# Altium project LED Oscilloscope.PrjPcb
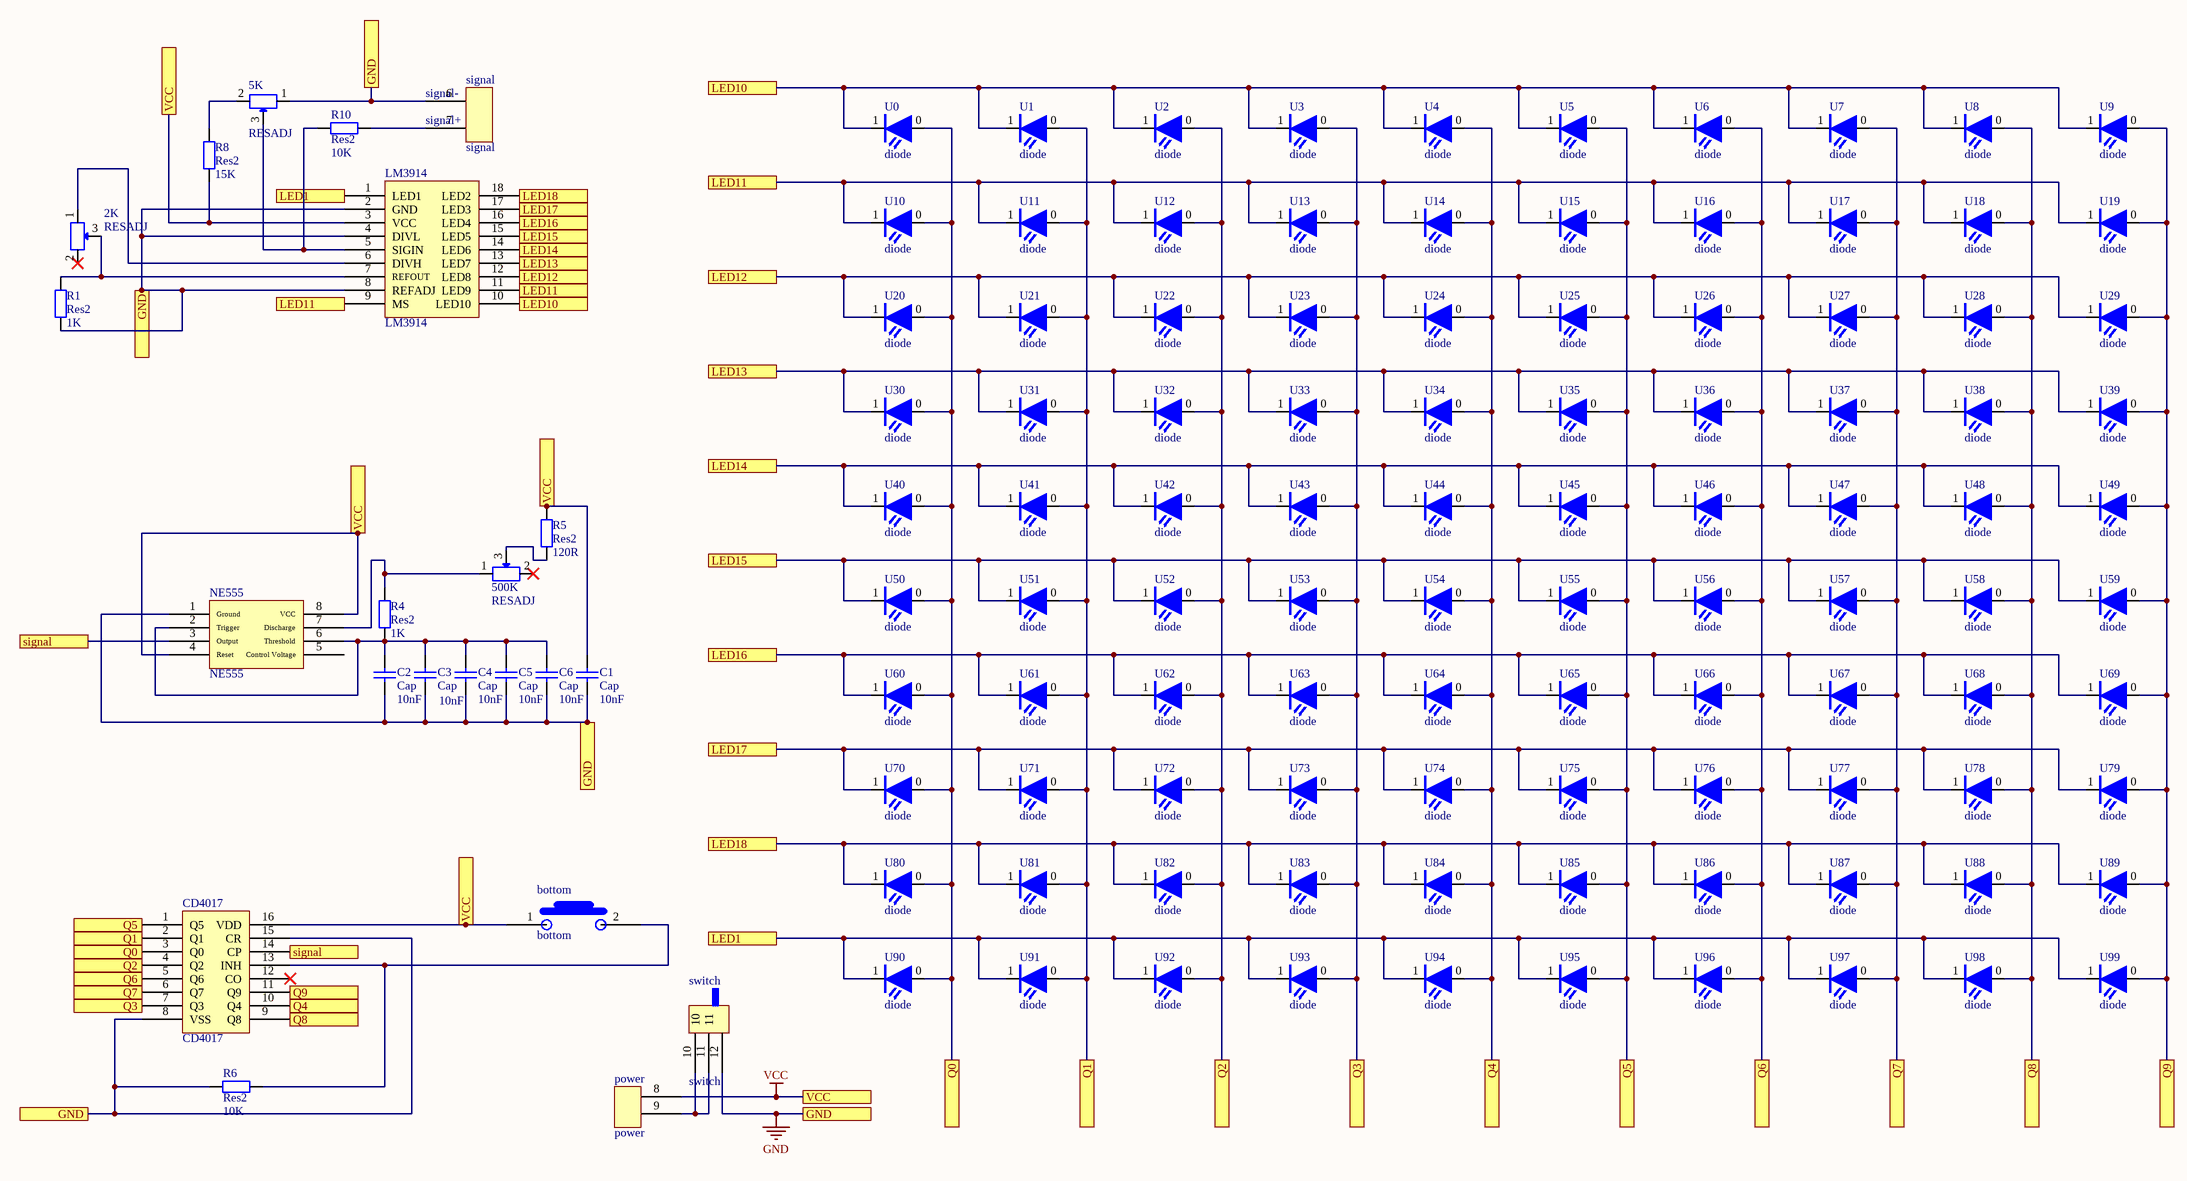
[diagram p0: LED Oscilloscope.SchDoc]
1 sheet, 122 parts. Net scope: flat (ports and power ports of the same name join across sheets).
Board file: LED Oscilloscope.PcbDoc

## Sheet LED Oscilloscope.SchDoc
size A2

### Parts
2K  RESADJ  [RESADJ]
5K  RESADJ  [RESADJ]
500K  RESADJ  [RESADJ]
bottom  bottom  [bottom]
C1  Cap  value 10nF  [RAD-0.3]
C2  Cap  value 10nF  [RAD-0.3]
C3  Cap  value 10nF  [RAD-0.3]
C4  Cap  value 10nF  [RAD-0.3]
C5  Cap  value 10nF  [RAD-0.3]
C6  Cap  value 10nF  [RAD-0.3]
CD4017  CD4017  [CD4017]
LM3914  LM3914  [LM3914]
NE555  NE555  [NE555 - duplicate]
power  power  [Power]
R1  Res2  value 1K  [AXIAL-0.4]
R4  Res2  value 1K  [AXIAL-0.4]
R5  Res2  value 120R  [AXIAL-0.4]
R6  Res2  value 10K  [AXIAL-0.4]
R8  Res2  value 15K  [AXIAL-0.4]
R10  Res2  value 10K  [AXIAL-0.4]
signal  signal  [signal]
switch  switch  [switch]
U0  diode  [LED]
U1  diode  [LED]
U2  diode  [LED]
U3  diode  [LED]
U4  diode  [LED]
U5  diode  [LED]
U6  diode  [LED]
U7  diode  [LED]
U8  diode  [LED]
U9  diode  [LED]
U10  diode  [LED]
U11  diode  [LED]
U12  diode  [LED]
U13  diode  [LED]
U14  diode  [LED]
U15  diode  [LED]
U16  diode  [LED]
U17  diode  [LED]
U18  diode  [LED]
U19  diode  [LED]
U20  diode  [LED]
U21  diode  [LED]
U22  diode  [LED]
U23  diode  [LED]
U24  diode  [LED]
U25  diode  [LED]
U26  diode  [LED]
U27  diode  [LED]
U28  diode  [LED]
U29  diode  [LED]
U30  diode  [LED]
U31  diode  [LED]
U32  diode  [LED]
U33  diode  [LED]
U34  diode  [LED]
U35  diode  [LED]
U36  diode  [LED]
U37  diode  [LED]
U38  diode  [LED]
U39  diode  [LED]
U40  diode  [LED]
U41  diode  [LED]
U42  diode  [LED]
U43  diode  [LED]
U44  diode  [LED]
U45  diode  [LED]
U46  diode  [LED]
U47  diode  [LED]
U48  diode  [LED]
U49  diode  [LED]
U50  diode  [LED]
U51  diode  [LED]
U52  diode  [LED]
U53  diode  [LED]
U54  diode  [LED]
U55  diode  [LED]
U56  diode  [LED]
U57  diode  [LED]
U58  diode  [LED]
U59  diode  [LED]
U60  diode  [LED]
U61  diode  [LED]
U62  diode  [LED]
U63  diode  [LED]
U64  diode  [LED]
U65  diode  [LED]
U66  diode  [LED]
U67  diode  [LED]
U68  diode  [LED]
U69  diode  [LED]
U70  diode  [LED]
U71  diode  [LED]
U72  diode  [LED]
U73  diode  [LED]
U74  diode  [LED]
U75  diode  [LED]
U76  diode  [LED]
U77  diode  [LED]
U78  diode  [LED]
U79  diode  [LED]
U80  diode  [LED]
U81  diode  [LED]
U82  diode  [LED]
U83  diode  [LED]
U84  diode  [LED]
U85  diode  [LED]
U86  diode  [LED]
U87  diode  [LED]
U88  diode  [LED]
U89  diode  [LED]
U90  diode  [LED]
U91  diode  [LED]
U92  diode  [LED]
U93  diode  [LED]
U94  diode  [LED]
U95  diode  [LED]
U96  diode  [LED]
U97  diode  [LED]
U98  diode  [LED]
U99  diode  [LED]

### Ports
GND, LED1, LED10, LED11, LED12, LED13, LED14, LED15, LED16, LED17, LED18, Q0, Q1, Q2, Q3, Q4, Q5, Q6, Q7, Q8, Q9, signal, VCC

### Nets
GND: 5K.1 C1.1 C2.1 C3.1 C4.1 C5.1 C6.1 CD4017.8(VSS) CD4017.15(CR) LM3914.2(GND) LM3914.4(DIVL) LM3914.8(REFADJ) NE555.1(Ground) R1.2 R6.1 signal.6 switch.12 ; port GND
VCC: bottom.1 C1.2 CD4017.16(VDD) LM3914.3(VCC) NE555.4(Reset) NE555.8(VCC) power.8 R5.1 R8.1 ; port VCC
Net2K_1: 2K.1 LM3914.6(DIVH)
Net2K_3: 2K.3 LM3914.7(REFOUT) R1.1
Net5K_2: 5K.2 R8.2
Net5K_3: 5K.3 LM3914.5(SIGIN) R10.1
Net500K_1: 500K.1 NE555.7(Discharge) R4.1
Net500K_3: 500K.3 R5.2
Netbottom_2: bottom.2 CD4017.13(INH) R6.2
NetC2_2: C2.2 C3.2 C4.2 C5.2 C6.2 NE555.2(Trigger) NE555.6(Threshold) R4.2
NetCD4017_1: CD4017.1(Q5) U5.0 U15.0 U25.0 U35.0 U45.0 U55.0 U65.0 U75.0 U85.0 U95.0 ; port Q5
NetCD4017_2: CD4017.2(Q1) U1.0 U11.0 U21.0 U31.0 U41.0 U51.0 U61.0 U71.0 U81.0 U91.0 ; port Q1
NetCD4017_3: CD4017.3(Q0) U0.0 U10.0 U20.0 U30.0 U40.0 U50.0 U60.0 U70.0 U80.0 U90.0 ; port Q0
NetCD4017_4: CD4017.4(Q2) U2.0 U12.0 U22.0 U32.0 U42.0 U52.0 U62.0 U72.0 U82.0 U92.0 ; port Q2
NetCD4017_5: CD4017.5(Q6) U6.0 U16.0 U26.0 U36.0 U46.0 U56.0 U66.0 U76.0 U86.0 U96.0 ; port Q6
NetCD4017_6: CD4017.6(Q7) U7.0 U17.0 U27.0 U37.0 U47.0 U57.0 U67.0 U77.0 U87.0 U97.0 ; port Q7
NetCD4017_7: CD4017.7(Q3) U3.0 U13.0 U23.0 U33.0 U43.0 U53.0 U63.0 U73.0 U83.0 U93.0 ; port Q3
NetCD4017_9: CD4017.9(Q8) U8.0 U18.0 U28.0 U38.0 U48.0 U58.0 U68.0 U78.0 U88.0 U98.0 ; port Q8
NetCD4017_10: CD4017.10(Q4) U4.0 U14.0 U24.0 U34.0 U44.0 U54.0 U64.0 U74.0 U84.0 U94.0 ; port Q4
NetCD4017_11: CD4017.11(Q9) U9.0 U19.0 U29.0 U39.0 U49.0 U59.0 U69.0 U79.0 U89.0 U99.0 ; port Q9
NetCD4017_14: CD4017.14(CP) NE555.3(Output) ; port signal
NetLM3914_1: LM3914.1(LED1) U90.1 U91.1 U92.1 U93.1 U94.1 U95.1 U96.1 U97.1 U98.1 U99.1 ; port LED1
NetLM3914_9: LM3914.9(MS) LM3914.11(LED9) U10.1 U11.1 U12.1 U13.1 U14.1 U15.1 U16.1 U17.1 U18.1 U19.1 ; port LED11
NetLM3914_10: LM3914.10(LED10) U0.1 U1.1 U2.1 U3.1 U4.1 U5.1 U6.1 U7.1 U8.1 U9.1 ; port LED10
NetLM3914_12: LM3914.12(LED8) U20.1 U21.1 U22.1 U23.1 U24.1 U25.1 U26.1 U27.1 U28.1 U29.1 ; port LED12
NetLM3914_13: LM3914.13(LED7) U30.1 U31.1 U32.1 U33.1 U34.1 U35.1 U36.1 U37.1 U38.1 U39.1 ; port LED13
NetLM3914_14: LM3914.14(LED6) U40.1 U41.1 U42.1 U43.1 U44.1 U45.1 U46.1 U47.1 U48.1 U49.1 ; port LED14
NetLM3914_15: LM3914.15(LED5) U50.1 U51.1 U52.1 U53.1 U54.1 U55.1 U56.1 U57.1 U58.1 U59.1 ; port LED15
NetLM3914_16: LM3914.16(LED4) U60.1 U61.1 U62.1 U63.1 U64.1 U65.1 U66.1 U67.1 U68.1 U69.1 ; port LED16
NetLM3914_17: LM3914.17(LED3) U70.1 U71.1 U72.1 U73.1 U74.1 U75.1 U76.1 U77.1 U78.1 U79.1 ; port LED17
NetLM3914_18: LM3914.18(LED2) U80.1 U81.1 U82.1 U83.1 U84.1 U85.1 U86.1 U87.1 U88.1 U89.1 ; port LED18
Netpower_9: power.9 switch.10 switch.11
NetR10_2: R10.2 signal.7

Not connected (* = marked no-connect by the designer): 2K 2(3)*; 500K 2(3)*; CD4017 12(CO)*; NE555 5(Control_Voltage)

### Notes on the sheet
- (near signal) signal-
- (near signal) signal+
- Title
- Size:
- Date:
- File:
- A2
- Number:
- Time:
- Revision:
- Sheet
- of

### Library data of the parts
C1-C6 = Cap: Capacitor; Published: 8-Jun-2000; LatestRevisionDate: 17-Jul-2002; LatestRevisionNote: Re-released for DXP Platform.; PackageReference: RAD-0.3; Publisher: Altium Limited; PackageDescription: Radial Cap, Thru-Hole; 2 Leads; 0.3 in Pin Spacing
R1 R4-R6 R8 R10 = Res2: Resistor; Published: 8-Jun-2000; LatestRevisionDate: 17-Jul-2002; LatestRevisionNote: Re-released for DXP Platform.; PackageReference: AXIAL-0.4; Publisher: Altium Limited; PackageDescription: Axial Device, Thru-Hole; 2 Leads; 0.4 in Pin Spacing
U0-U99 = diode: own use